# Altium schematic sheet LCD.SchDoc
size A4
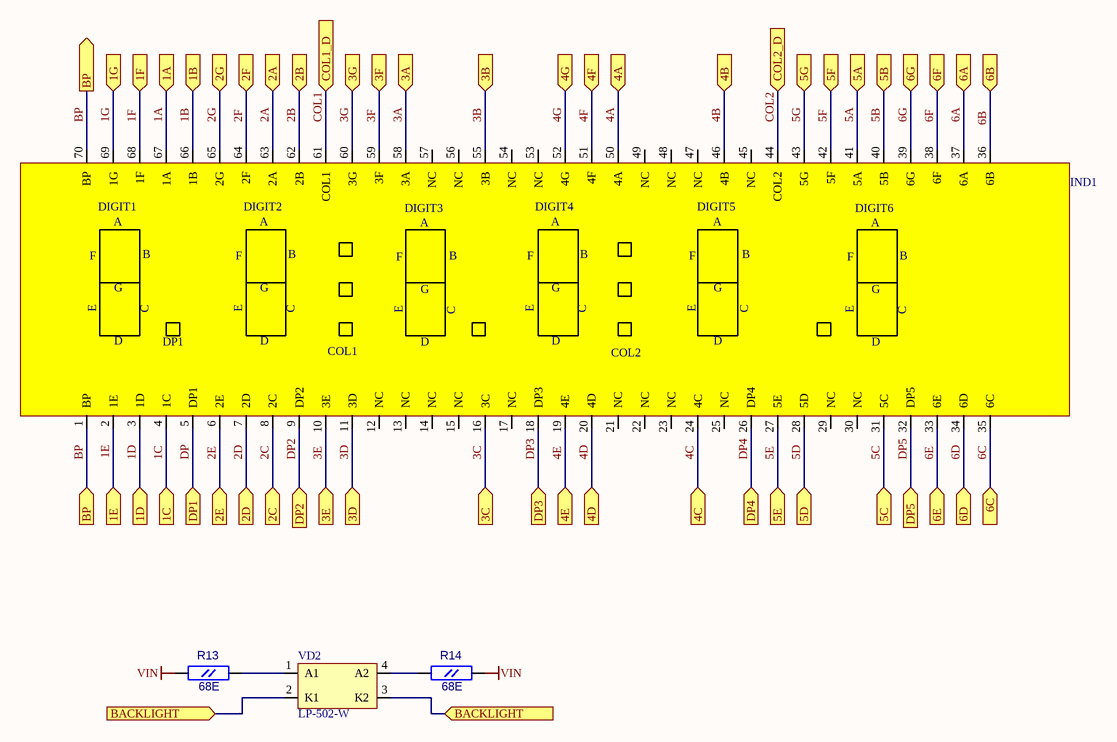
[diagram p0: LCD.SchDoc]

## Parts
IND1  DE156  [IND_DE156]  (value not drawn)
R13  68E  [RC0603]
R14  68E  [RC0603]
VD2  LP-502-W  [LP-502-W]

## Ports
1A (in), 1B (in), 1C (in), 1D (in), 1E (in), 1F (in), 1G (in), 2A (in), 2B (in), 2C (in), 2D (in), 2E (in), 2F (in), 2G (in), 3A (in), 3B (in), 3C (in), 3D (in), 3E (in), 3F (in), 3G (in), 4A (in), 4B (in), 4C (in), 4D (in), 4E (in), 4F (in), 4G (in), 5A (in), 5B (in), 5C (in), 5D (in), 5E (in), 5F (in), 5G (in), 6A (in), 6B (in), 6C (in), 6D (in), 6E (in), 6F (in), 6G (in), BACKLIGHT (in), BP (in), BP (out), COL1_D (in), COL2_D (in), DP1 (in), DP2 (in), DP3 (in), DP4 (in), DP5 (in)

## Nets
VIN: R13.1(A) R14.2(B)
1A: IND1.67(1A) ; port 1A
1B: IND1.66(1B) ; port 1B
1C: IND1.4(1C) ; port 1C
1D: IND1.3(1D) ; port 1D
1E: IND1.2(1E) ; port 1E
1F: IND1.68(1F) ; port 1F
1G: IND1.69(1G) ; port 1G
2A: IND1.63(2A) ; port 2A
2B: IND1.62(2B) ; port 2B
2C: IND1.8(2C) ; port 2C
2D: IND1.7(2D) ; port 2D
2E: IND1.6(2E) ; port 2E
2F: IND1.64(2F) ; port 2F
2G: IND1.65(2G) ; port 2G
3A: IND1.58(3A) ; port 3A
3B: IND1.55(3B) ; port 3B
3C: IND1.16(3C) ; port 3C
3D: IND1.11(3D) ; port 3D
3E: IND1.10(3E) ; port 3E
3F: IND1.59(3F) ; port 3F
3G: IND1.60(3G) ; port 3G
4A: IND1.50(4A) ; port 4A
4B: IND1.46(4B) ; port 4B
4C: IND1.24(4C) ; port 4C
4D: IND1.20(4D) ; port 4D
4E: IND1.19(4E) ; port 4E
4F: IND1.51(4F) ; port 4F
4G: IND1.52(4G) ; port 4G
5A: IND1.41(5A) ; port 5A
5B: IND1.40(5B) ; port 5B
5C: IND1.31(5C) ; port 5C
5D: IND1.28(5D) ; port 5D
5E: IND1.27(5E) ; port 5E
5F: IND1.42(5F) ; port 5F
5G: IND1.43(5G) ; port 5G
6A: IND1.37(6A) ; port 6A
6B: IND1.36(6B) ; port 6B
6C: IND1.35(6C) ; port 6C
6D: IND1.34(6D) ; port 6D
6E: IND1.33(6E) ; port 6E
6F: IND1.38(6F) ; port 6F
6G: IND1.39(6G) ; port 6G
BACKLIGHT: VD2.2(K1) VD2.3(K2) ; port BACKLIGHT
BP: IND1.1(BP) IND1.70(BP) ; port BP
COL1: IND1.61(COL1) ; port COL1_D
COL2: IND1.44(COL2) ; port COL2_D
DP: IND1.5(DP1) ; port DP1
DP2: IND1.9(DP2) ; port DP2
DP3: IND1.18(DP3) ; port DP3
DP4: IND1.26(DP4) ; port DP4
DP5: IND1.32(DP5) ; port DP5
NetR13_2: R13.2(B) VD2.1(A1)
NetR14_1: R14.1(A) VD2.4(A2)

Not connected (* = marked no-connect by the designer): IND1 12(NC) 13(NC) 14(NC) 15(NC) 17(NC) 21(NC) 22(NC) 23(NC) 25(NC) 29(NC) 30(NC) 45(NC) 47(NC) 48(NC) 49(NC) 53(NC) 54(NC) 56(NC) 57(NC)

## Notes on the sheet
- (in symbol IND7_DE156) DIGIT1; DIGIT2; DIGIT3; DIGIT4; DIGIT5; DIGIT6; A; F; B; G; E; C; D

## Library data of the parts
IND1 = IND7_DE156: 6digit 7Segment indicator; Value: DE156
R13 R14 = RC0603: Value: 68E
VD2 = LP-502-W: Backlight for lcd display; Value: LP-502-W